# Altium schematic sheet Battery Protection.SchDoc
size A; SheetNumber: 3; SheetTotal: 4
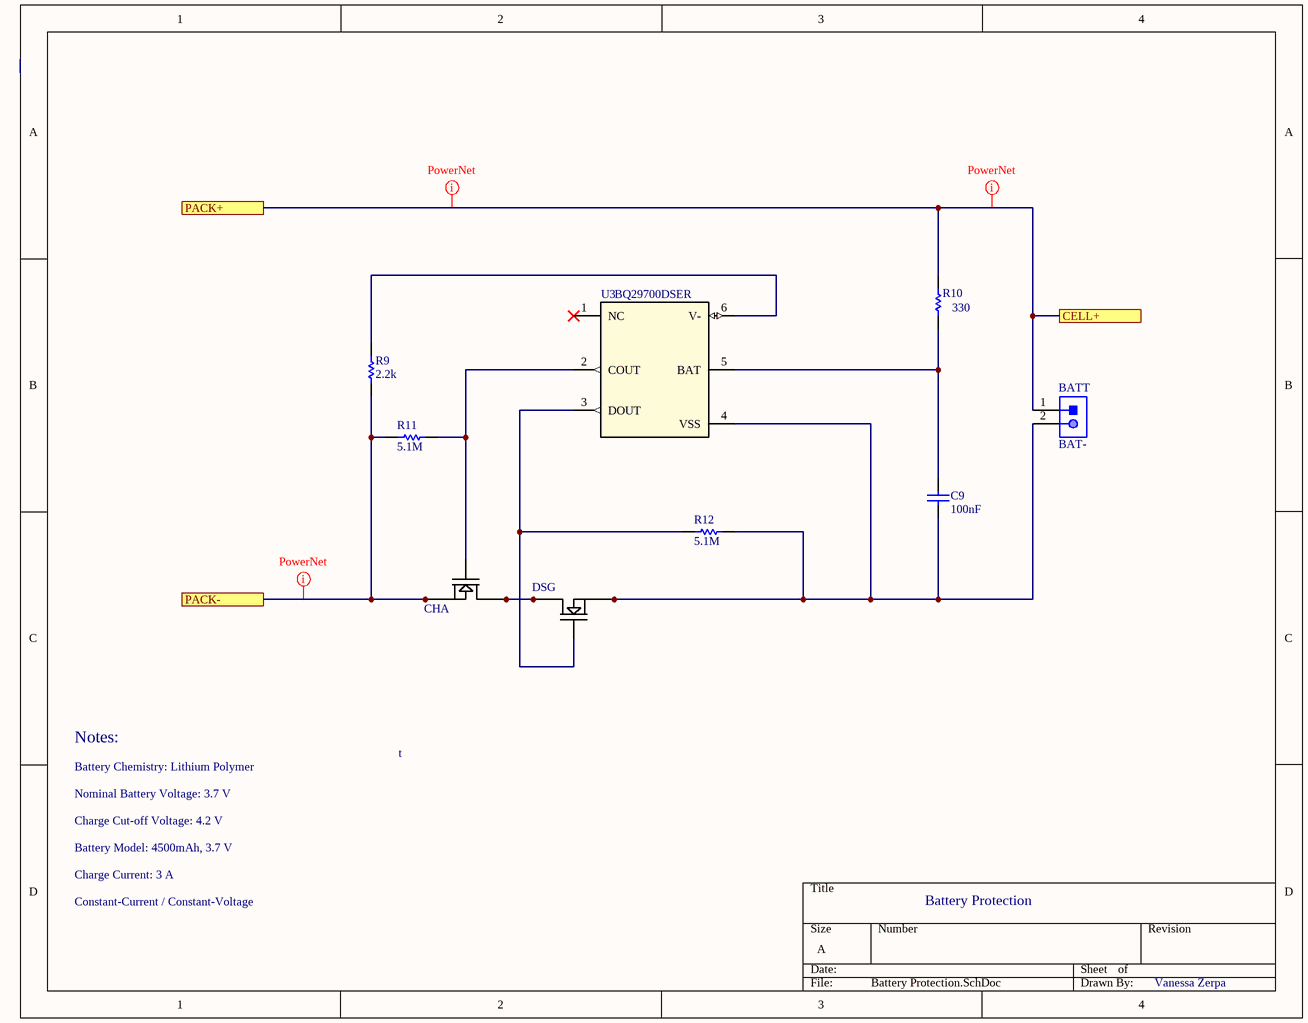
[diagram p0: Battery Protection.SchDoc]

## Parts
BATT  BAT-  [JST-S2B-PH-K-S_V]
C9  100nF  [CAPC2013X94X50NL20T25]
CHA  CSD16406Q3  [DQG0008A]  (value not drawn)
DSG  CSD16406Q3  [DQG0008A]  (value not drawn)
R9  2.2k  [RESC2013X60X40LL20T25]
R10  330  [RESC2013X70X40ML20T20]
R11  5.1M  [RESC2013X70X40ML20T20]
R12  5.1M  [RESC2013X70X40ML20T20]
U3  BQ29700DSER  [DSE0006A]

## Ports
CELL+, PACK+, PACK-

## Nets
CELL+: BATT.1 R10.2 ; port PACK+, port CELL+
PACK-: CHA.1(Source) CHA.2(Source) CHA.3(Source) R9.1 R11.1 ; port PACK-
NetBATT_2: BATT.2 C9.1 DSG.1(Source) DSG.2(Source) DSG.3(Source) R12.2 U3.4(VSS)
NetC9_2: C9.2 R10.1 U3.5(BAT)
NetCHA_4: CHA.4(Gate) R11.2 U3.2(COUT)
NetCHA_5: CHA.5(Drain) CHA.6(Drain) CHA.7(Drain) CHA.8(Drain) CHA.9(Drain) DSG.5(Drain) DSG.6(Drain) DSG.7(Drain) DSG.8(Drain) DSG.9(Drain)
NetDSG_4: DSG.4(Gate) R12.1 U3.3(DOUT)
NetR9_2: R9.2 U3.6(V-)

Not connected (* = marked no-connect by the designer): U3 1(NC)*

## Layout directives
net class PowerNets: CELL+, PACK-

## Notes on the sheet
- Notes:
- Battery Chemistry: Lithium Polymer
- t
- Nominal Battery Voltage: 3.7 V
- Charge Cut-off Voltage: 4.2 V
- Battery Model: 4500mAh, 3.7 V
- Charge Current: 3 A
- Constant-Current / Constant-Voltage
- Battery Protection
- Vanessa Zerpa

## Library data of the parts
BATT = CMP-1755-00004-1: Male Header, Pitch 2 mm, 1 x 2 Position, Height 4.8 mm, Tail Length 3.4 mm, -25 to 85 degC, RoHS, Bulk; Case\Package: Radial; Tolerance: 20%; Capacitance: 10 uF; Voltage Rating (DC): 50 V; Packaging: Bulk; ComponentLink1URL: http://www.jst-mfg.com/product/pdf/eng/ePH.pdf; Radiation Hardening: No; Height: 11 mm; Package Quantity: 200; PackageDescription: Male Header, Pitch 2 mm, 1 x 2 Position, Height 4.8 mm, Tail Length 3.4 mm; PackageReference: S2B-PH-K-S; Diameter: 5 mm; Pins: 2; Mount: Through Hole; Max Operating Temperature: 85 degC; Min Operating Temperature: -40 degC; ComponentLink1Description: Datasheet; DatasheetVersion: Dec-12; Length: 11 mm; Lead Pitch: 2 mm; REACH SVHC: No SVHC; Voltage Rating: 50 V; RoHSCompliant: true
C9 = CMP-1036-04419-2: Manufacturer: AVX Interconnect / Elco; Part Number: 08055C104KAT4A
CHA DSG = CSD16406Q3: No Description Available; Mfr_Name: Texas Instruments; Copyright: Copyright (C) 2021 Ultra Librarian. All rights reserved.; Manufacturer_Part_Number: CSD16406Q3; RefDes: RefDes; Type: DEV
R9 = CMP-2001-00613-1: Manufacturer: Panasonic; Part Number: ERA6AEB222V
R10 = CMP-1013-00062-2: Manufacturer: Panasonic; Part Number: ERJ-6GEYJ331V
R11 R12 = CMP-2001-00430-1: Part Number: ERJ-6GEYJ515V; Manufacturer: Panasonic
U3 = BQ29700DSER: No Description Available; Mfr_Name: Texas Instruments; Type: DEV; RefDes: RefDes; Copyright: Copyright (C) 2021 Ultra Librarian. All rights reserved.; Manufacturer_Part_Number: BQ29700DSER